# Altium schematic sheet Root.SchDoc
size A4; SheetNumber: 1; SheetTotal: 5
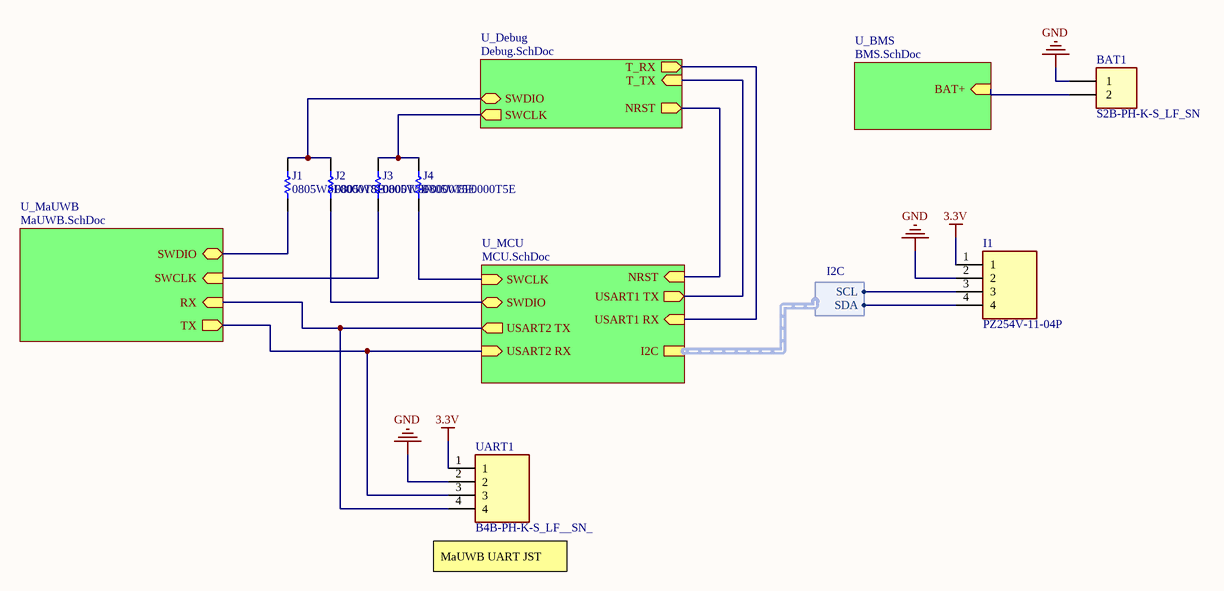
[diagram p0: Root.SchDoc]

## Parts
BAT1  S2B-PH-K-S_LF_SN  [S2B-PH-K-S_LF_SN]
I1  PZ254V-11-04P  [HDRV4W64P0X254_1X4_1016X250X890P]
J1  0805W8F0000T5E  [RESC2013X65N - Duplicate1]
J2  0805W8F0000T5E  [RESC2013X65N - Duplicate1]
J3  0805W8F0000T5E  [RESC2013X65N - Duplicate1]
J4  0805W8F0000T5E  [RESC2013X65N - Duplicate1]
UART1  B4B-PH-K-S_LF__SN_  [SHDR4W50P0X200_1X4_990X450X600P]

## Sub-sheets
U_BMS = BMS.SchDoc: BAT+ (in)
U_Debug = Debug.SchDoc: SWDIO (bidir), SWCLK (out), NRST (out), T_TX (in), T_RX (out)
U_MaUWB = MaUWB.SchDoc: SWCLK (in), SWDIO (bidir), RX (in), TX (out)
U_MCU = MCU.SchDoc: NRST (in), USART2 RX (in), USART2 TX (out), SWCLK (in), SWDIO (bidir), I2C (harness I2C), USART1 RX (in), USART1 TX (out)

## Harnesses
I2C: SCL, SDA

## Nets
3.3V: I1.1 UART1.1
GND: BAT1.1 I1.2 UART1.2
NetBAT1_2: BAT1.2 ; sheet U_BMS/BAT+
NetI1_3: I1.3 ; sheet U_MCU/I2C.SCL
NetI1_4: I1.4 ; sheet U_MCU/I2C.SDA
NetJ1_1: J1.1 ; sheet U_MaUWB/SWDIO
NetJ1_2: J1.2 J2.2 ; sheet U_Debug/SWDIO
NetJ2_1: J2.1 ; sheet U_MCU/SWDIO
NetJ3_1: J3.1 ; sheet U_MaUWB/SWCLK
NetJ3_2: J3.2 J4.2 ; sheet U_Debug/SWCLK
NetJ4_1: J4.1 ; sheet U_MCU/SWCLK
NetUART1_3: UART1.3 ; sheet U_MaUWB/TX, sheet U_MCU/USART2 RX
NetUART1_4: UART1.4 ; sheet U_MaUWB/RX, sheet U_MCU/USART2 TX
(unnamed): sheet U_MCU/NRST, sheet U_Debug/NRST
(unnamed): sheet U_MCU/USART1 RX, sheet U_Debug/T_RX
(unnamed): sheet U_MCU/USART1 TX, sheet U_Debug/T_TX

## Notes on the sheet
- (near UART1) MaUWB UART JST

## Library data of the parts
BAT1 = S2B-PH-K-S_LF_SN: -25℃~+85℃ 1 100V 1x2P 2 2A 2P 2mm 4.8mm 5.9mm 7.6mm Brass K Pin PA66 PH Right Angle Tin UL94V-0 White 弯插,P=2mm Wire To Board Connector ROHS; Manufacturer: JST; Manu Part #: S2B-PH-K-S(LF)(SN); LCSC Part #: C173752
I1 = PZ254V-11-04P: 4 pin 2.54mm Header; Manufacturer_Name: XFCN; Manufacturer_Part_Number: PZ254V-11-04P; LCSC Part #: C2691448
J1-J4 = 0805W8F0000T5E: 0 Ohm, 0805, 1%; Manufacturer_Name: UNI-ROYAL(Uniroyal Elec); Height: 0.65mm; LCSC Part #: C17477; Manu Part #: 0805W8F0000T5E
UART1 = B4B-PH-K-S_LF__SN_: JST 4 pin; Manufacturer_Name: JST (JAPAN SOLDERLESS TERMINALS); Manu Part #: B4B-PH-K-S(LF)(SN); Datasheet Link: https://datasheet.lcsc.com/szlcsc/JST-Sales-America-B4B-PH-K-S-LF-SN_C131334.pdf; Height: 6mm; LCSC Part #: C131334